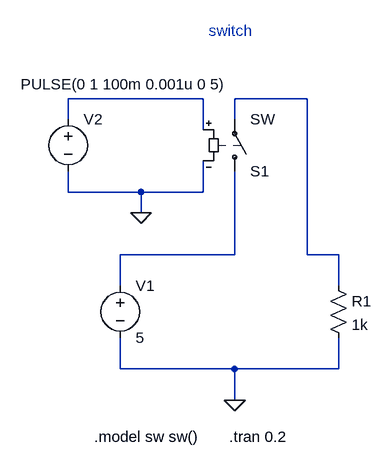
[diagram p0: schematic SPDTswitch.asc]
SPDTswitch.asc, the LTspice schematic file:
Version 4
SHEET 1 880 680
WIRE 352 -16 144 -16
WIRE 512 -16 400 -16
WIRE 144 16 144 -16
WIRE 400 16 400 -16
WIRE 352 32 352 -16
WIRE 144 128 144 96
WIRE 256 128 144 128
WIRE 352 128 352 80
WIRE 352 128 256 128
WIRE 256 160 256 128
WIRE 400 224 400 96
WIRE 400 224 224 224
WIRE 512 224 512 -16
WIRE 560 224 512 224
WIRE 224 272 224 224
WIRE 560 272 560 224
WIRE 224 400 224 352
WIRE 400 400 224 400
WIRE 560 400 560 352
WIRE 560 400 400 400
WIRE 400 448 400 400
FLAG 400 448 0
FLAG 256 160 0
SYMBOL Voltage 224 256 R0
SYMATTR InstName V1
SYMATTR Value 5
SYMBOL Res 544 256 R0
SYMATTR InstName R1
SYMATTR Value 1k
SYMBOL Voltage 144 0 R0
WINDOW 3 -73 -38 Left 2
SYMATTR Value PULSE(0 1 100m 0.001u 0 5)
SYMATTR InstName V2
SYMBOL sw 400 112 M180
SYMATTR InstName S1
TEXT 392 504 Left 2 !.tran 0.2
TEXT 184 504 Left 2 !.model sw sw()
TEXT 360 -120 Left 2 ;switch

The netlist it stands for:
* SPDTswitch.asc
V1 N003 0 5
R1 N002 0 1k
V2 N001 0 PULSE(0 1 100m 0.001u 0 5)
S1 N003 N002 N001 0 SW
.tran 0.2
.model sw sw()
* switch
.backanno
.end